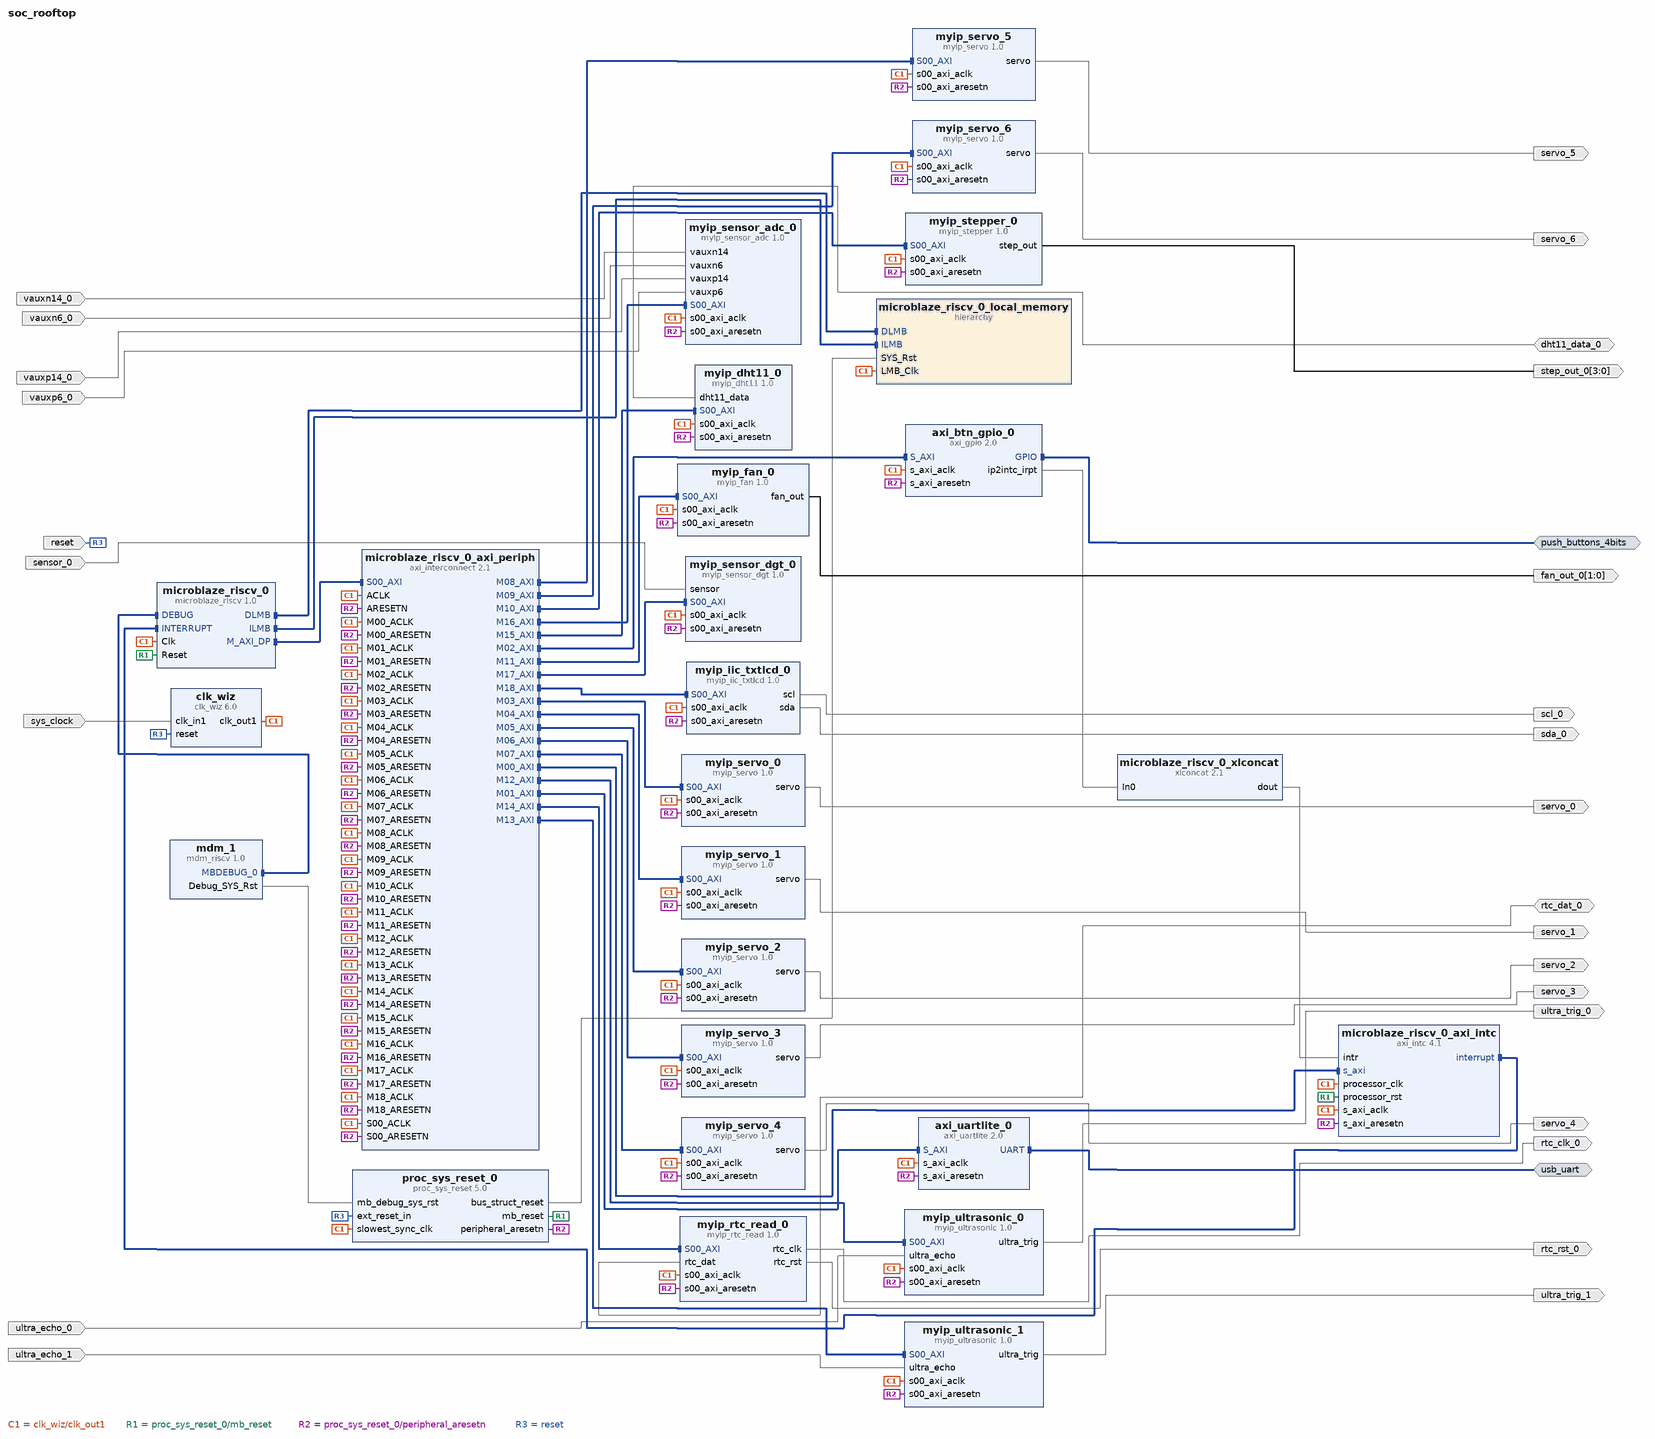
[diagram p0: block diagram of the top level]
# Vivado block design soc_rooftop, xc7a35tcpg236-1, Vivado 2024.2
create_bd_design soc_rooftop

create_bd_intf_port -mode Master -vlnv xilinx.com:interface:gpio_rtl:1.0 push_buttons_4bits
create_bd_intf_port -mode Master -vlnv xilinx.com:interface:uart_rtl:1.0 usb_uart
create_bd_port -dir I -type rst reset
set_property -dict {CONFIG.POLARITY ACTIVE_HIGH} [get_bd_ports reset]
create_bd_port -dir I -type clk sys_clock
set_property -dict {CONFIG.FREQ_HZ 100000000 CONFIG.PHASE 0.0} [get_bd_ports sys_clock]
create_bd_port -dir O servo_0
create_bd_port -dir O servo_1
create_bd_port -dir O servo_2
create_bd_port -dir O servo_3
create_bd_port -dir O servo_4
create_bd_port -dir O servo_5
create_bd_port -dir O servo_6
create_bd_port -dir O -from 3 -to 0 step_out_0
create_bd_port -dir O -from 1 -to 0 fan_out_0
create_bd_port -dir I ultra_echo_0
create_bd_port -dir O ultra_trig_0
create_bd_port -dir I ultra_echo_1
create_bd_port -dir O ultra_trig_1
create_bd_port -dir O -type clk rtc_clk_0
create_bd_port -dir IO rtc_dat_0
create_bd_port -dir O -type rst rtc_rst_0
create_bd_port -dir IO dht11_data_0
create_bd_port -dir I vauxn14_0
create_bd_port -dir I vauxn6_0
create_bd_port -dir I vauxp14_0
create_bd_port -dir I vauxp6_0
create_bd_port -dir I sensor_0
create_bd_port -dir O scl_0
create_bd_port -dir O sda_0

create_bd_cell -type ip -vlnv xilinx.com:ip:proc_sys_reset:5.0 proc_sys_reset_0
set_property -dict {CONFIG.RESET_BOARD_INTERFACE reset CONFIG.USE_BOARD_FLOW true} [get_bd_cells proc_sys_reset_0]
create_bd_cell -type ip -vlnv xilinx.com:ip:clk_wiz:6.0 clk_wiz
set_property -dict [list \
  CONFIG.CLKOUT1_REQUESTED_OUT_FREQ 100.0 \
  CONFIG.CLK_IN1_BOARD_INTERFACE sys_clock \
  CONFIG.RESET_BOARD_INTERFACE reset \
  CONFIG.USE_BOARD_FLOW true \
] [get_bd_cells clk_wiz]
create_bd_cell -type ip -vlnv xilinx.com:ip:microblaze_riscv:1.0 microblaze_riscv_0
set_property -dict [list \
  CONFIG.C_DEBUG_ENABLED 1 \
  CONFIG.C_D_AXI 1 \
  CONFIG.C_D_LMB 1 \
  CONFIG.C_I_LMB 1 \
  CONFIG.G_TEMPLATE_LIST 1 \
] [get_bd_cells microblaze_riscv_0]
create_bd_cell -type hier microblaze_riscv_0_local_memory
create_bd_cell -type ip -vlnv xilinx.com:ip:axi_interconnect:2.1 microblaze_riscv_0_axi_periph
set_property -dict {CONFIG.NUM_MI 19} [get_bd_cells microblaze_riscv_0_axi_periph]
create_bd_cell -type ip -vlnv xilinx.com:ip:axi_intc:4.1 microblaze_riscv_0_axi_intc
set_property -dict {CONFIG.C_HAS_FAST 1} [get_bd_cells microblaze_riscv_0_axi_intc]
create_bd_cell -type ip -vlnv xilinx.com:ip:xlconcat:2.1 microblaze_riscv_0_xlconcat
create_bd_cell -type ip -vlnv xilinx.com:ip:mdm_riscv:1.0 mdm_1
create_bd_cell -type ip -vlnv xilinx.com:ip:axi_gpio:2.0 axi_btn_gpio_0
set_property -dict [list \
  CONFIG.C_INTERRUPT_PRESENT 1 \
  CONFIG.GPIO_BOARD_INTERFACE push_buttons_4bits \
  CONFIG.USE_BOARD_FLOW true \
] [get_bd_cells axi_btn_gpio_0]
create_bd_cell -type ip -vlnv user.org:user:myip_servo:1.0 myip_servo_0
create_bd_cell -type ip -vlnv user.org:user:myip_servo:1.0 myip_servo_1
create_bd_cell -type ip -vlnv user.org:user:myip_servo:1.0 myip_servo_2
create_bd_cell -type ip -vlnv user.org:user:myip_servo:1.0 myip_servo_3
create_bd_cell -type ip -vlnv user.org:user:myip_servo:1.0 myip_servo_4
create_bd_cell -type ip -vlnv user.org:user:myip_servo:1.0 myip_servo_5
create_bd_cell -type ip -vlnv user.org:user:myip_servo:1.0 myip_servo_6
create_bd_cell -type ip -vlnv user.org:user:myip_stepper:1.0 myip_stepper_0
create_bd_cell -type ip -vlnv user.org:user:myip_fan:1.0 myip_fan_0
create_bd_cell -type ip -vlnv user.org:user:myip_ultrasonic:1.0 myip_ultrasonic_0
create_bd_cell -type ip -vlnv user.org:user:myip_ultrasonic:1.0 myip_ultrasonic_1
create_bd_cell -type ip -vlnv user.org:user:myip_rtc_read:1.0 myip_rtc_read_0
create_bd_cell -type ip -vlnv user.org:user:myip_dht11:1.0 myip_dht11_0
create_bd_cell -type ip -vlnv user.org:user:myip_sensor_adc:1.0 myip_sensor_adc_0
create_bd_cell -type ip -vlnv user.org:user:myip_sensor_dgt:1.0 myip_sensor_dgt_0
create_bd_cell -type ip -vlnv user.org:user:myip_iic_txtlcd:1.0 myip_iic_txtlcd_0
create_bd_cell -type ip -vlnv xilinx.com:ip:axi_uartlite:2.0 axi_uartlite_0
set_property -dict {CONFIG.UARTLITE_BOARD_INTERFACE usb_uart CONFIG.USE_BOARD_FLOW true} [get_bd_cells axi_uartlite_0]

# ---- hierarchy /microblaze_riscv_0_local_memory ----
current_bd_instance /microblaze_riscv_0_local_memory
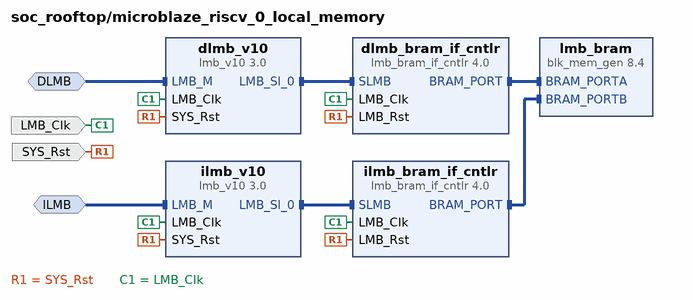
[diagram p1: block diagram inside /microblaze_riscv_0_local_memory]
create_bd_intf_pin -mode MirroredMaster -vlnv xilinx.com:interface:lmb_rtl:1.0 DLMB
create_bd_intf_pin -mode MirroredMaster -vlnv xilinx.com:interface:lmb_rtl:1.0 ILMB
create_bd_pin -dir I -type clk LMB_Clk
create_bd_pin -dir I -type rst SYS_Rst

create_bd_cell -type ip -vlnv xilinx.com:ip:lmb_v10:3.0 dlmb_v10
create_bd_cell -type ip -vlnv xilinx.com:ip:lmb_v10:3.0 ilmb_v10
create_bd_cell -type ip -vlnv xilinx.com:ip:lmb_bram_if_cntlr:4.0 dlmb_bram_if_cntlr
set_property -dict {CONFIG.C_ECC 0} [get_bd_cells dlmb_bram_if_cntlr]
create_bd_cell -type ip -vlnv xilinx.com:ip:lmb_bram_if_cntlr:4.0 ilmb_bram_if_cntlr
set_property -dict {CONFIG.C_ECC 0} [get_bd_cells ilmb_bram_if_cntlr]
create_bd_cell -type ip -vlnv xilinx.com:ip:blk_mem_gen:8.4 lmb_bram
set_property -dict {CONFIG.Memory_Type True_Dual_Port_RAM CONFIG.use_bram_block BRAM_Controller} [get_bd_cells lmb_bram]

# ---- connections ----

current_bd_instance /microblaze_riscv_0_local_memory
connect_bd_intf_net -intf_net microblaze_riscv_0_dlmb [get_bd_intf_pins dlmb_v10/LMB_M] [get_bd_intf_pins DLMB]
connect_bd_intf_net -intf_net microblaze_riscv_0_dlmb_bus [get_bd_intf_pins dlmb_v10/LMB_Sl_0] [get_bd_intf_pins dlmb_bram_if_cntlr/SLMB]
connect_bd_intf_net -intf_net microblaze_riscv_0_dlmb_cntlr [get_bd_intf_pins dlmb_bram_if_cntlr/BRAM_PORT] [get_bd_intf_pins lmb_bram/BRAM_PORTA]
connect_bd_intf_net -intf_net microblaze_riscv_0_ilmb [get_bd_intf_pins ilmb_v10/LMB_M] [get_bd_intf_pins ILMB]
connect_bd_intf_net -intf_net microblaze_riscv_0_ilmb_bus [get_bd_intf_pins ilmb_v10/LMB_Sl_0] [get_bd_intf_pins ilmb_bram_if_cntlr/SLMB]
connect_bd_intf_net -intf_net microblaze_riscv_0_ilmb_cntlr [get_bd_intf_pins ilmb_bram_if_cntlr/BRAM_PORT] [get_bd_intf_pins lmb_bram/BRAM_PORTB]
connect_bd_net [get_bd_pins SYS_Rst] \
  [get_bd_pins dlmb_v10/SYS_Rst] [get_bd_pins dlmb_bram_if_cntlr/LMB_Rst] [get_bd_pins ilmb_v10/SYS_Rst] \
  [get_bd_pins ilmb_bram_if_cntlr/LMB_Rst]
connect_bd_net -net microblaze_riscv_0_Clk [get_bd_pins LMB_Clk] \
  [get_bd_pins dlmb_v10/LMB_Clk] [get_bd_pins dlmb_bram_if_cntlr/LMB_Clk] [get_bd_pins ilmb_v10/LMB_Clk] \
  [get_bd_pins ilmb_bram_if_cntlr/LMB_Clk]
set_property HDL_ATTRIBUTE.BMM_INFO_ADDRESS_SPACE {byte  0x00000000 32 > soc_rooftop microblaze_riscv_0_local_memory/lmb_bram} [get_bd_cells dlmb_bram_if_cntlr]
set_property HDL_ATTRIBUTE.KEEP_HIERARCHY yes [get_bd_cells dlmb_bram_if_cntlr]

current_bd_instance /
connect_bd_intf_net -intf_net axi_gpio_0_GPIO [get_bd_intf_ports push_buttons_4bits] [get_bd_intf_pins axi_btn_gpio_0/GPIO]
connect_bd_intf_net [get_bd_intf_ports usb_uart] [get_bd_intf_pins axi_uartlite_0/UART]
connect_bd_intf_net -intf_net microblaze_riscv_0_axi_dp [get_bd_intf_pins microblaze_riscv_0_axi_periph/S00_AXI] [get_bd_intf_pins microblaze_riscv_0/M_AXI_DP]
connect_bd_intf_net [get_bd_intf_pins microblaze_riscv_0_axi_periph/M01_AXI] [get_bd_intf_pins axi_uartlite_0/S_AXI]
connect_bd_intf_net [get_bd_intf_pins microblaze_riscv_0_axi_periph/M02_AXI] [get_bd_intf_pins axi_btn_gpio_0/S_AXI]
connect_bd_intf_net [get_bd_intf_pins microblaze_riscv_0_axi_periph/M03_AXI] [get_bd_intf_pins myip_servo_0/S00_AXI]
connect_bd_intf_net [get_bd_intf_pins microblaze_riscv_0_axi_periph/M04_AXI] [get_bd_intf_pins myip_servo_1/S00_AXI]
connect_bd_intf_net [get_bd_intf_pins microblaze_riscv_0_axi_periph/M05_AXI] [get_bd_intf_pins myip_servo_2/S00_AXI]
connect_bd_intf_net [get_bd_intf_pins microblaze_riscv_0_axi_periph/M06_AXI] [get_bd_intf_pins myip_servo_3/S00_AXI]
connect_bd_intf_net [get_bd_intf_pins microblaze_riscv_0_axi_periph/M07_AXI] [get_bd_intf_pins myip_servo_4/S00_AXI]
connect_bd_intf_net [get_bd_intf_pins microblaze_riscv_0_axi_periph/M08_AXI] [get_bd_intf_pins myip_servo_5/S00_AXI]
connect_bd_intf_net [get_bd_intf_pins microblaze_riscv_0_axi_periph/M09_AXI] [get_bd_intf_pins myip_servo_6/S00_AXI]
connect_bd_intf_net [get_bd_intf_pins microblaze_riscv_0_axi_periph/M10_AXI] [get_bd_intf_pins myip_stepper_0/S00_AXI]
connect_bd_intf_net [get_bd_intf_pins microblaze_riscv_0_axi_periph/M11_AXI] [get_bd_intf_pins myip_fan_0/S00_AXI]
connect_bd_intf_net [get_bd_intf_pins microblaze_riscv_0_axi_periph/M12_AXI] [get_bd_intf_pins myip_ultrasonic_0/S00_AXI]
connect_bd_intf_net [get_bd_intf_pins microblaze_riscv_0_axi_periph/M13_AXI] [get_bd_intf_pins myip_ultrasonic_1/S00_AXI]
connect_bd_intf_net [get_bd_intf_pins microblaze_riscv_0_axi_periph/M14_AXI] [get_bd_intf_pins myip_rtc_read_0/S00_AXI]
connect_bd_intf_net [get_bd_intf_pins microblaze_riscv_0_axi_periph/M15_AXI] [get_bd_intf_pins myip_dht11_0/S00_AXI]
connect_bd_intf_net [get_bd_intf_pins microblaze_riscv_0_axi_periph/M16_AXI] [get_bd_intf_pins myip_sensor_adc_0/S00_AXI]
connect_bd_intf_net [get_bd_intf_pins microblaze_riscv_0_axi_periph/M17_AXI] [get_bd_intf_pins myip_sensor_dgt_0/S00_AXI]
connect_bd_intf_net [get_bd_intf_pins microblaze_riscv_0_axi_periph/M18_AXI] [get_bd_intf_pins myip_iic_txtlcd_0/S00_AXI]
connect_bd_intf_net [get_bd_intf_pins mdm_1/MBDEBUG_0] [get_bd_intf_pins microblaze_riscv_0/DEBUG]
connect_bd_intf_net [get_bd_intf_pins microblaze_riscv_0/DLMB] [get_bd_intf_pins microblaze_riscv_0_local_memory/DLMB]
connect_bd_intf_net [get_bd_intf_pins microblaze_riscv_0/ILMB] [get_bd_intf_pins microblaze_riscv_0_local_memory/ILMB]
connect_bd_intf_net -intf_net microblaze_riscv_0_intc_axi [get_bd_intf_pins microblaze_riscv_0_axi_periph/M00_AXI] [get_bd_intf_pins microblaze_riscv_0_axi_intc/s_axi]
connect_bd_intf_net [get_bd_intf_pins microblaze_riscv_0_axi_intc/interrupt] [get_bd_intf_pins microblaze_riscv_0/INTERRUPT]
connect_bd_net [get_bd_ports rtc_dat_0] [get_bd_pins myip_rtc_read_0/rtc_dat]
connect_bd_net [get_bd_ports dht11_data_0] [get_bd_pins myip_dht11_0/dht11_data]
connect_bd_net [get_bd_pins axi_btn_gpio_0/ip2intc_irpt] [get_bd_pins microblaze_riscv_0_xlconcat/In0]
connect_bd_net [get_bd_pins mdm_1/Debug_SYS_Rst] [get_bd_pins proc_sys_reset_0/mb_debug_sys_rst]
connect_bd_net -net microblaze_riscv_0_Clk [get_bd_pins clk_wiz/clk_out1] \
  [get_bd_pins proc_sys_reset_0/slowest_sync_clk] [get_bd_pins microblaze_riscv_0/Clk] \
  [get_bd_pins microblaze_riscv_0_axi_periph/ACLK] [get_bd_pins microblaze_riscv_0_axi_periph/S00_ACLK] \
  [get_bd_pins microblaze_riscv_0_axi_periph/M00_ACLK] [get_bd_pins microblaze_riscv_0_axi_intc/s_axi_aclk] \
  [get_bd_pins microblaze_riscv_0_axi_intc/processor_clk] [get_bd_pins microblaze_riscv_0_local_memory/LMB_Clk] \
  [get_bd_pins microblaze_riscv_0_axi_periph/M01_ACLK] [get_bd_pins axi_btn_gpio_0/s_axi_aclk] \
  [get_bd_pins microblaze_riscv_0_axi_periph/M02_ACLK] [get_bd_pins myip_servo_0/s00_axi_aclk] \
  [get_bd_pins microblaze_riscv_0_axi_periph/M03_ACLK] [get_bd_pins myip_servo_1/s00_axi_aclk] \
  [get_bd_pins microblaze_riscv_0_axi_periph/M04_ACLK] [get_bd_pins myip_servo_2/s00_axi_aclk] \
  [get_bd_pins microblaze_riscv_0_axi_periph/M05_ACLK] [get_bd_pins myip_servo_3/s00_axi_aclk] \
  [get_bd_pins microblaze_riscv_0_axi_periph/M06_ACLK] [get_bd_pins myip_servo_4/s00_axi_aclk] \
  [get_bd_pins microblaze_riscv_0_axi_periph/M07_ACLK] [get_bd_pins myip_servo_5/s00_axi_aclk] \
  [get_bd_pins microblaze_riscv_0_axi_periph/M08_ACLK] [get_bd_pins myip_servo_6/s00_axi_aclk] \
  [get_bd_pins microblaze_riscv_0_axi_periph/M09_ACLK] [get_bd_pins microblaze_riscv_0_axi_periph/M10_ACLK] \
  [get_bd_pins microblaze_riscv_0_axi_periph/M11_ACLK] [get_bd_pins myip_stepper_0/s00_axi_aclk] \
  [get_bd_pins myip_fan_0/s00_axi_aclk] [get_bd_pins myip_ultrasonic_0/s00_axi_aclk] \
  [get_bd_pins microblaze_riscv_0_axi_periph/M12_ACLK] [get_bd_pins myip_ultrasonic_1/s00_axi_aclk] \
  [get_bd_pins microblaze_riscv_0_axi_periph/M13_ACLK] [get_bd_pins myip_rtc_read_0/s00_axi_aclk] \
  [get_bd_pins microblaze_riscv_0_axi_periph/M14_ACLK] [get_bd_pins myip_dht11_0/s00_axi_aclk] \
  [get_bd_pins microblaze_riscv_0_axi_periph/M15_ACLK] [get_bd_pins myip_sensor_adc_0/s00_axi_aclk] \
  [get_bd_pins microblaze_riscv_0_axi_periph/M16_ACLK] [get_bd_pins myip_sensor_dgt_0/s00_axi_aclk] \
  [get_bd_pins microblaze_riscv_0_axi_periph/M17_ACLK] [get_bd_pins myip_iic_txtlcd_0/s00_axi_aclk] \
  [get_bd_pins microblaze_riscv_0_axi_periph/M18_ACLK] [get_bd_pins axi_uartlite_0/s_axi_aclk]
connect_bd_net -net microblaze_riscv_0_intr [get_bd_pins microblaze_riscv_0_xlconcat/dout] [get_bd_pins microblaze_riscv_0_axi_intc/intr]
connect_bd_net [get_bd_pins myip_fan_0/fan_out] [get_bd_ports fan_out_0]
connect_bd_net [get_bd_pins myip_iic_txtlcd_0/scl] [get_bd_ports scl_0]
connect_bd_net [get_bd_pins myip_iic_txtlcd_0/sda] [get_bd_ports sda_0]
connect_bd_net [get_bd_pins myip_rtc_read_0/rtc_clk] [get_bd_ports rtc_clk_0]
connect_bd_net [get_bd_pins myip_rtc_read_0/rtc_rst] [get_bd_ports rtc_rst_0]
connect_bd_net [get_bd_pins myip_servo_0/servo] [get_bd_ports servo_0]
connect_bd_net [get_bd_pins myip_servo_1/servo] [get_bd_ports servo_1]
connect_bd_net [get_bd_pins myip_servo_2/servo] [get_bd_ports servo_2]
connect_bd_net [get_bd_pins myip_servo_3/servo] [get_bd_ports servo_3]
connect_bd_net [get_bd_pins myip_servo_4/servo] [get_bd_ports servo_4]
connect_bd_net [get_bd_pins myip_servo_5/servo] [get_bd_ports servo_5]
connect_bd_net [get_bd_pins myip_servo_6/servo] [get_bd_ports servo_6]
connect_bd_net [get_bd_pins myip_stepper_0/step_out] [get_bd_ports step_out_0]
connect_bd_net [get_bd_pins myip_ultrasonic_0/ultra_trig] [get_bd_ports ultra_trig_0]
connect_bd_net [get_bd_pins myip_ultrasonic_1/ultra_trig] [get_bd_ports ultra_trig_1]
connect_bd_net [get_bd_pins proc_sys_reset_0/bus_struct_reset] [get_bd_pins microblaze_riscv_0_local_memory/SYS_Rst]
connect_bd_net [get_bd_pins proc_sys_reset_0/mb_reset] [get_bd_pins microblaze_riscv_0/Reset] [get_bd_pins microblaze_riscv_0_axi_intc/processor_rst]
connect_bd_net [get_bd_pins proc_sys_reset_0/peripheral_aresetn] \
  [get_bd_pins microblaze_riscv_0_axi_periph/ARESETN] [get_bd_pins microblaze_riscv_0_axi_periph/S00_ARESETN] \
  [get_bd_pins microblaze_riscv_0_axi_periph/M00_ARESETN] [get_bd_pins microblaze_riscv_0_axi_intc/s_axi_aresetn] \
  [get_bd_pins microblaze_riscv_0_axi_periph/M01_ARESETN] [get_bd_pins axi_btn_gpio_0/s_axi_aresetn] \
  [get_bd_pins microblaze_riscv_0_axi_periph/M02_ARESETN] [get_bd_pins myip_servo_0/s00_axi_aresetn] \
  [get_bd_pins microblaze_riscv_0_axi_periph/M03_ARESETN] [get_bd_pins myip_servo_1/s00_axi_aresetn] \
  [get_bd_pins microblaze_riscv_0_axi_periph/M04_ARESETN] [get_bd_pins myip_servo_2/s00_axi_aresetn] \
  [get_bd_pins microblaze_riscv_0_axi_periph/M05_ARESETN] [get_bd_pins myip_servo_3/s00_axi_aresetn] \
  [get_bd_pins microblaze_riscv_0_axi_periph/M06_ARESETN] [get_bd_pins myip_servo_4/s00_axi_aresetn] \
  [get_bd_pins microblaze_riscv_0_axi_periph/M07_ARESETN] [get_bd_pins myip_servo_5/s00_axi_aresetn] \
  [get_bd_pins microblaze_riscv_0_axi_periph/M08_ARESETN] [get_bd_pins myip_servo_6/s00_axi_aresetn] \
  [get_bd_pins microblaze_riscv_0_axi_periph/M09_ARESETN] [get_bd_pins microblaze_riscv_0_axi_periph/M10_ARESETN] \
  [get_bd_pins microblaze_riscv_0_axi_periph/M11_ARESETN] [get_bd_pins myip_stepper_0/s00_axi_aresetn] \
  [get_bd_pins myip_fan_0/s00_axi_aresetn] [get_bd_pins myip_ultrasonic_0/s00_axi_aresetn] \
  [get_bd_pins microblaze_riscv_0_axi_periph/M12_ARESETN] [get_bd_pins myip_ultrasonic_1/s00_axi_aresetn] \
  [get_bd_pins microblaze_riscv_0_axi_periph/M13_ARESETN] [get_bd_pins myip_rtc_read_0/s00_axi_aresetn] \
  [get_bd_pins microblaze_riscv_0_axi_periph/M14_ARESETN] [get_bd_pins myip_dht11_0/s00_axi_aresetn] \
  [get_bd_pins microblaze_riscv_0_axi_periph/M15_ARESETN] [get_bd_pins myip_sensor_adc_0/s00_axi_aresetn] \
  [get_bd_pins microblaze_riscv_0_axi_periph/M16_ARESETN] [get_bd_pins myip_sensor_dgt_0/s00_axi_aresetn] \
  [get_bd_pins microblaze_riscv_0_axi_periph/M17_ARESETN] [get_bd_pins myip_iic_txtlcd_0/s00_axi_aresetn] \
  [get_bd_pins microblaze_riscv_0_axi_periph/M18_ARESETN] [get_bd_pins axi_uartlite_0/s_axi_aresetn]
connect_bd_net [get_bd_ports reset] [get_bd_pins proc_sys_reset_0/ext_reset_in] [get_bd_pins clk_wiz/reset]
connect_bd_net -net sensor_0_1 [get_bd_ports sensor_0] [get_bd_pins myip_sensor_dgt_0/sensor]
connect_bd_net [get_bd_ports sys_clock] [get_bd_pins clk_wiz/clk_in1]
connect_bd_net -net ultra_echo_0_1 [get_bd_ports ultra_echo_0] [get_bd_pins myip_ultrasonic_0/ultra_echo]
connect_bd_net -net ultra_echo_1_1 [get_bd_ports ultra_echo_1] [get_bd_pins myip_ultrasonic_1/ultra_echo]
connect_bd_net -net vauxn14_0_1 [get_bd_ports vauxn14_0] [get_bd_pins myip_sensor_adc_0/vauxn14]
connect_bd_net -net vauxn6_0_1 [get_bd_ports vauxn6_0] [get_bd_pins myip_sensor_adc_0/vauxn6]
connect_bd_net -net vauxp14_0_1 [get_bd_ports vauxp14_0] [get_bd_pins myip_sensor_adc_0/vauxp14]
connect_bd_net -net vauxp6_0_1 [get_bd_ports vauxp6_0] [get_bd_pins myip_sensor_adc_0/vauxp6]
set_property HDL_ATTRIBUTE.BMM_INFO_PROCESSOR {riscv > soc_rooftop microblaze_riscv_0_local_memory/dlmb_bram_if_cntlr} [get_bd_cells microblaze_riscv_0]
set_property HDL_ATTRIBUTE.KEEP_HIERARCHY yes [get_bd_cells microblaze_riscv_0]

# ---- address map ----
assign_bd_address -offset 0x00000000 -range 128K -target_address_space [get_bd_addr_spaces microblaze_riscv_0/Data] [get_bd_addr_segs microblaze_riscv_0_local_memory/dlmb_bram_if_cntlr/SLMB/Mem]
assign_bd_address -offset 0x40000000 -range 64K -target_address_space [get_bd_addr_spaces microblaze_riscv_0/Data] [get_bd_addr_segs axi_btn_gpio_0/S_AXI/Reg]
assign_bd_address -offset 0x40600000 -range 64K -target_address_space [get_bd_addr_spaces microblaze_riscv_0/Data] [get_bd_addr_segs axi_uartlite_0/S_AXI/Reg]
assign_bd_address -offset 0x41200000 -range 64K -target_address_space [get_bd_addr_spaces microblaze_riscv_0/Data] [get_bd_addr_segs microblaze_riscv_0_axi_intc/S_AXI/Reg]
assign_bd_address -offset 0x44A00000 -range 64K -target_address_space [get_bd_addr_spaces microblaze_riscv_0/Data] [get_bd_addr_segs myip_servo_0/S00_AXI/S00_AXI_reg]
assign_bd_address -offset 0x44A10000 -range 64K -target_address_space [get_bd_addr_spaces microblaze_riscv_0/Data] [get_bd_addr_segs myip_servo_1/S00_AXI/S00_AXI_reg]
assign_bd_address -offset 0x44A20000 -range 64K -target_address_space [get_bd_addr_spaces microblaze_riscv_0/Data] [get_bd_addr_segs myip_servo_2/S00_AXI/S00_AXI_reg]
assign_bd_address -offset 0x44A30000 -range 64K -target_address_space [get_bd_addr_spaces microblaze_riscv_0/Data] [get_bd_addr_segs myip_servo_3/S00_AXI/S00_AXI_reg]
assign_bd_address -offset 0x44A40000 -range 64K -target_address_space [get_bd_addr_spaces microblaze_riscv_0/Data] [get_bd_addr_segs myip_servo_4/S00_AXI/S00_AXI_reg]
assign_bd_address -offset 0x44A50000 -range 64K -target_address_space [get_bd_addr_spaces microblaze_riscv_0/Data] [get_bd_addr_segs myip_servo_5/S00_AXI/S00_AXI_reg]
assign_bd_address -offset 0x44A60000 -range 64K -target_address_space [get_bd_addr_spaces microblaze_riscv_0/Data] [get_bd_addr_segs myip_servo_6/S00_AXI/S00_AXI_reg]
assign_bd_address -offset 0x44A70000 -range 64K -target_address_space [get_bd_addr_spaces microblaze_riscv_0/Data] [get_bd_addr_segs myip_stepper_0/S00_AXI/S00_AXI_reg]
assign_bd_address -offset 0x44A80000 -range 64K -target_address_space [get_bd_addr_spaces microblaze_riscv_0/Data] [get_bd_addr_segs myip_fan_0/S00_AXI/S00_AXI_reg]
assign_bd_address -offset 0x44A90000 -range 64K -target_address_space [get_bd_addr_spaces microblaze_riscv_0/Data] [get_bd_addr_segs myip_ultrasonic_0/S00_AXI/S00_AXI_reg]
assign_bd_address -offset 0x44AA0000 -range 64K -target_address_space [get_bd_addr_spaces microblaze_riscv_0/Data] [get_bd_addr_segs myip_ultrasonic_1/S00_AXI/S00_AXI_reg]
assign_bd_address -offset 0x44AB0000 -range 64K -target_address_space [get_bd_addr_spaces microblaze_riscv_0/Data] [get_bd_addr_segs myip_rtc_read_0/S00_AXI/S00_AXI_reg]
assign_bd_address -offset 0x44AC0000 -range 64K -target_address_space [get_bd_addr_spaces microblaze_riscv_0/Data] [get_bd_addr_segs myip_dht11_0/S00_AXI/S00_AXI_reg]
assign_bd_address -offset 0x44AD0000 -range 64K -target_address_space [get_bd_addr_spaces microblaze_riscv_0/Data] [get_bd_addr_segs myip_sensor_adc_0/S00_AXI/S00_AXI_reg]
assign_bd_address -offset 0x44AE0000 -range 64K -target_address_space [get_bd_addr_spaces microblaze_riscv_0/Data] [get_bd_addr_segs myip_sensor_dgt_0/S00_AXI/S00_AXI_reg]
assign_bd_address -offset 0x44AF0000 -range 64K -target_address_space [get_bd_addr_spaces microblaze_riscv_0/Data] [get_bd_addr_segs myip_iic_txtlcd_0/S00_AXI/S00_AXI_reg]
assign_bd_address -offset 0x00000000 -range 128K -target_address_space [get_bd_addr_spaces microblaze_riscv_0/Instruction] [get_bd_addr_segs microblaze_riscv_0_local_memory/ilmb_bram_if_cntlr/SLMB/Mem]

validate_bd_design
save_bd_design
